# EAGLE schematic ACPL (EAGLE 8.0.1)
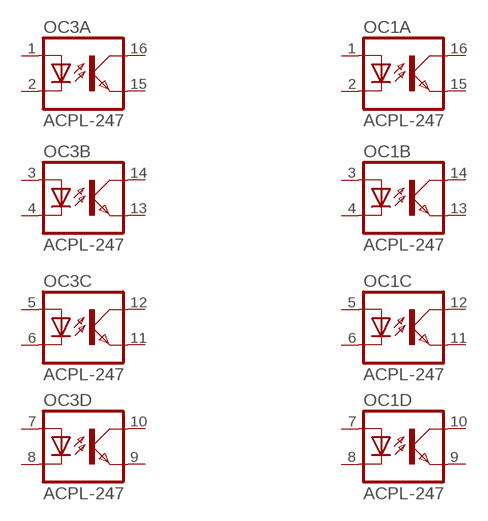
[diagram p0: schematic, sheet 1]

## Parts
OC1  ACPL-247  [SOP16]
OC3  ACPL-247  [SOP16]
Unconnected: OC1.1(A:A) OC1.2(A:C) OC1.3(B:A) OC1.4(B:C) OC1.5(C:A) OC1.6(C:C) OC1.7(D:A) OC1.8(D:C) OC1.9(D:EMIT) OC1.10(D:COL) OC1.11(C:EMIT) OC1.12(C:COL) OC1.13(B:EMIT) OC1.14(B:COL) OC1.15(A:EMIT) OC1.16(A:COL) OC3.1(A:A) OC3.2(A:C) OC3.3(B:A) OC3.4(B:C) OC3.5(C:A) OC3.6(C:C) OC3.7(D:A) OC3.8(D:C) OC3.9(D:EMIT) OC3.10(D:COL) OC3.11(C:EMIT) OC3.12(C:COL) OC3.13(B:EMIT) OC3.14(B:COL) OC3.15(A:EMIT) OC3.16(A:COL)

## Library data of the parts
OC1 OC3 = avago:ACPL-247

## Net classes
3 power_relay: width 0.508 mm, drill 0.406 mm, clearance 0.203 mm